# EAGLE schematic schematic (EAGLE 9.6.2)
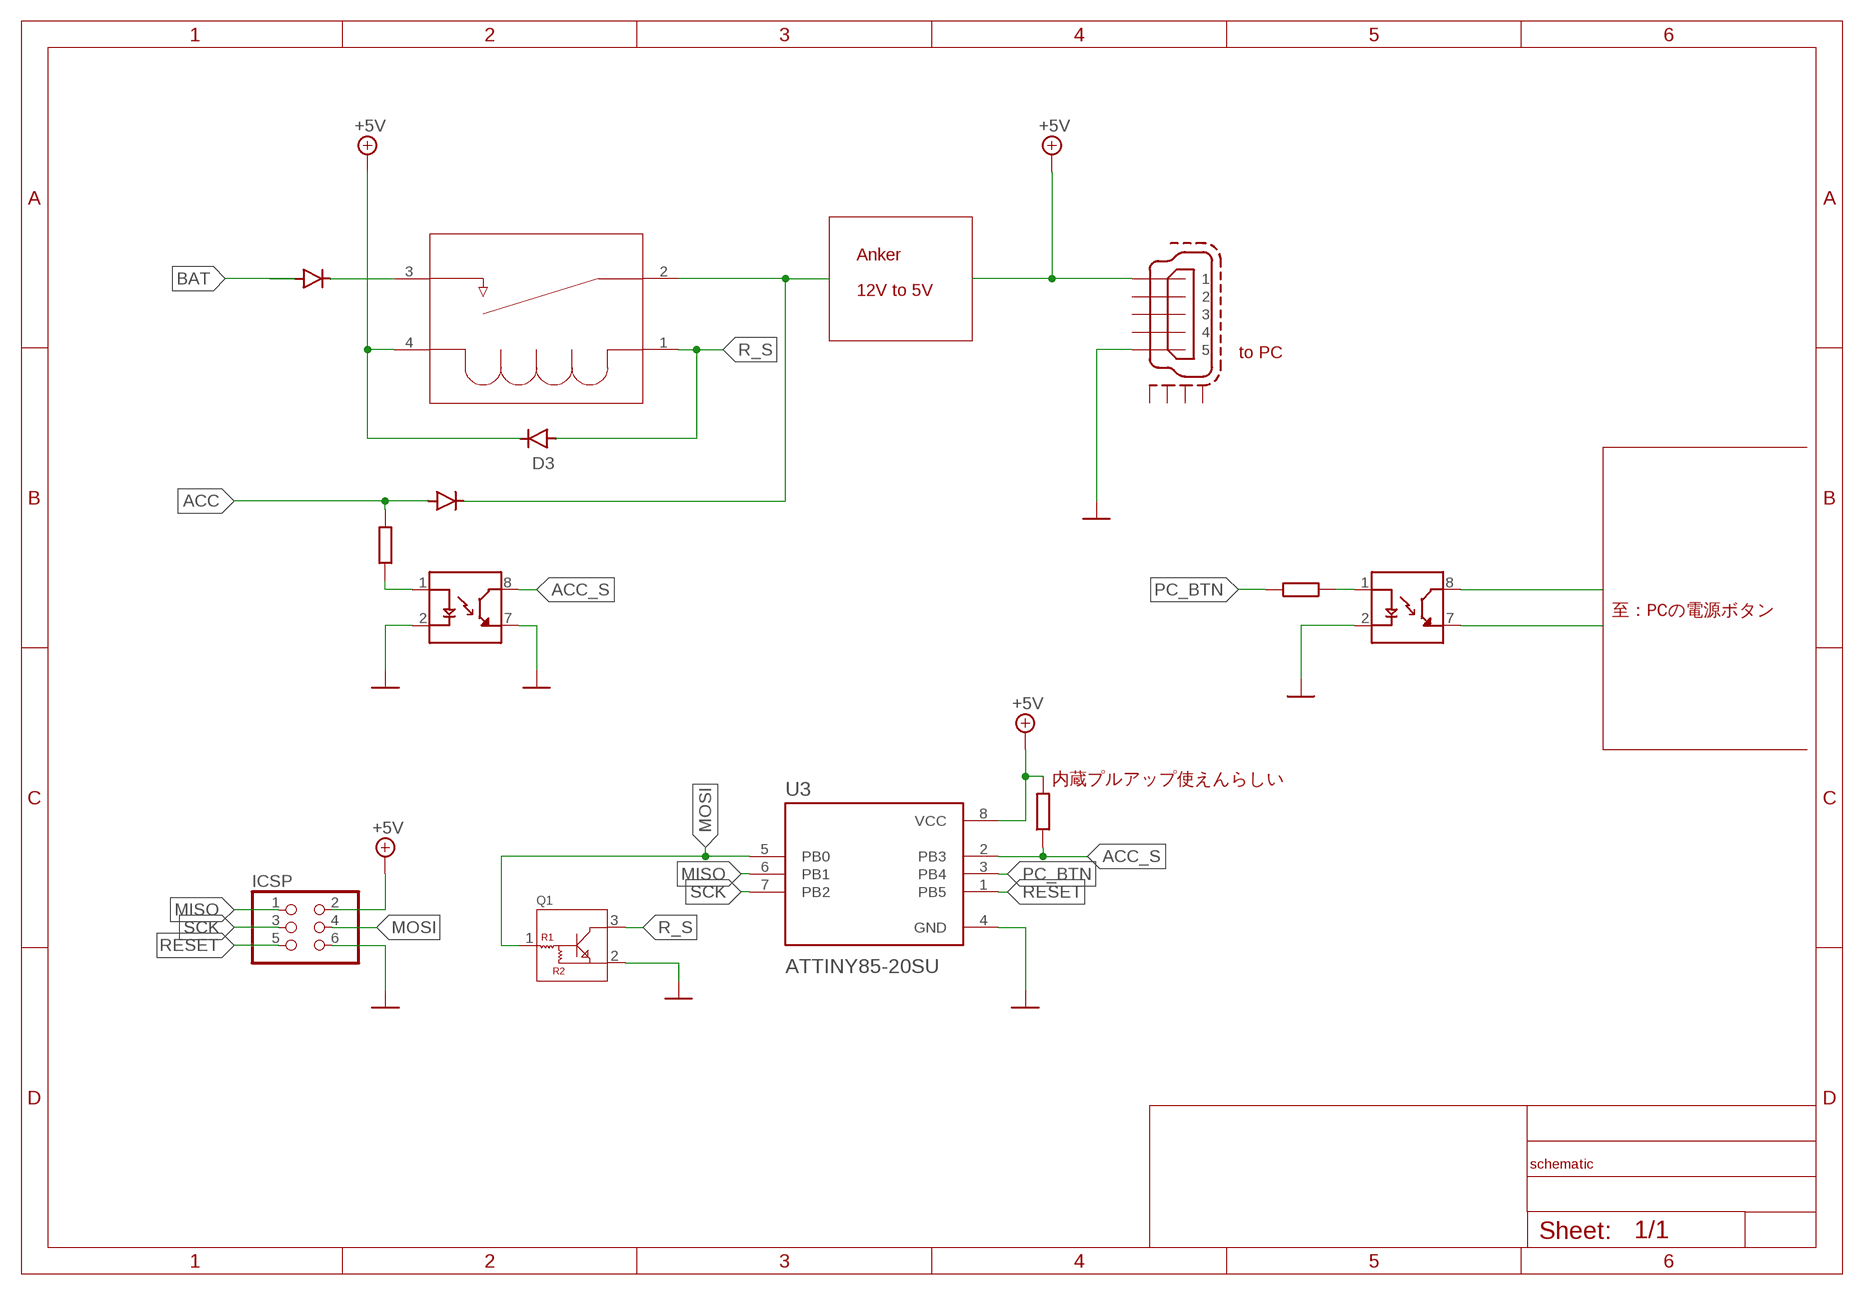
[diagram p0: schematic, sheet 1]

## Parts
D1  1N4004  [DO-41]
D3  1N4004  [DO-41]
D4  1N4004  [DO-41]
ICSP  PINHD-2X3  [2X03]
Q1  DTC114EM3T5G  [VMT3]
R1  R-EU_0204/5  [0204/5]
R2  R-EU_0204/5  [0204/5]
R3  R-EU_0204/5  [0204/5]
U1  2-1393222-0  [RELAY6-4-394X1126_591]
U2  TLP627-2  [DIP762W50P254L966H455Q8]
U3  ATTINY85-20SU  [SOIC127P798X216-8N]
U4  TLP627-2  [DIP762W50P254L966H455Q8]
X1  C-05843_USB-MINI-B32005-201  [32005-201]

## Nets
+5V: D3.C ICSP.2 R2.2 U1.4 U3.8(VCC) X1.1
ACC: D4.A D4.C R1.2 U1.2
ACC_S: R2.1 U2.8(CT1) U3.2(PB3)
BAT: D1.A
GND: ICSP.6 Q1.2 U2.2(C1) U2.7(ET1) U3.4(GND) U4.2(C1) X1.5
MISO: ICSP.1 U3.6(PB1)
MOSI: ICSP.4 Q1.1 U3.5(PB0)
N$1: D1.C U1.3
N$3: R1.1 U2.1(A1)
N$4: U4.8(CT1)
N$5: U4.7(ET1)
N$7: R3.1 U4.1(A1)
PC_BTN: R3.2 U3.3(PB4)
R_S: D3.A Q1.3 U1.1
RESET: ICSP.5 U3.1(PB5)
SCK: ICSP.3 U3.7(PB2)
Unconnected: U2.3(A2) U2.4(C2) U2.5(ET2) U2.6(CT2) U4.3(A2) U4.4(C2) U4.5(ET2) U4.6(CT2) X1.2 X1.3 X1.4 X1.M1(S:S1) X1.M2(S:S2) X1.M3(S:S3) X1.M4(S:S4)

## Notes on the sheet
- Anker
- 12V to 5V
- to PC
- 至：PCの電源ボタン
- 内蔵プルアップ使えんらしい

## Library data of the parts
D1 D3 D4 = Diodes:1N4004: DIODE GEN PURP 400V 1A DO41 Manufacturer's datasheet <https://www.mccsemi.com/pdf/Products/1N4001-1N4007(DO-41).pdf>; CREATED_BY: PCBLayout.com; DIGIKEY_PART_NUMBER: 1N4004MSCT-ND; MANUFACTURER: Micro Commercial Co; MPN: 1N4004; PACKAGE: DO-41
ICSP = pinhead:PINHD-2X3: PIN HEADER
Q1 = DTC114E:DTC114E: NPN Silicon Surface Mount Transistors with Monolithic Bias Resistor Network R1 = R2 = 10K Check availability <https://pricing.snapeda.com/parts/DTC114E/Nexperia%20USA/view-part?ref=eda>; AVAILABILITY: In Stock; DESCRIPTION: Pre-Biased Bipolar Transistor (BJT) NPN - Pre-Biased 50V 50mA 250MHz 200mW Surface Mount SMT3; MF: Nexperia USA; MP: DTC114E; PACKAGE: SC-59 Nexperia USA; PRICE: None; PURCHASE-URL: https://pricing.snapeda.com/search/part/DTC114E/?ref=eda
R1-R3 = rcl:R-EU_: RESISTOR, European symbol; SPICEPREFIX: R
U1 = Relays:2-1393222-0; BUILT_BY: EMA_UL_Team; CATEGORY: Power Relays; COPYRIGHT: Copyright (C) 2016 Accelerated Designs. All rights reserved; DESCRIPTION: V23061A1005A302=MINISTARKSTROM; MANUFACTURER_PART_NUMBER: 2-1393222-0; PART_STATUS: active; SERIES: SCHRACK Low Power PCB Relays; VENDOR: TE Connectivity
U2 U4 = TLP627-2:TLP627-2: Optoisolator Output Channel Check availability <https://pricing.snapeda.com/parts/TLP627-2/Toshiba/view-part?ref=eda>; AVAILABILITY: In Stock; DESCRIPTION: Optoisolator Output Channel; MF: Toshiba; MP: TLP627-2; PACKAGE: DIP-8 Toshiba; PRICE: None; PURCHASE-URL: https://pricing.snapeda.com/search/part/TLP627-2/?ref=eda
U3 = ATTINY85-20SU:ATTINY85-20SU: AVR AVR® ATtiny, Functional Safety (FuSa) Microcontroller IC 8-Bit 20MHz 8KB (4K x 16) FLASH 8-SOIC Check availability <https://pricing.snapeda.com/parts/ATTINY85-20SU/Microchip%20Technology%20/%20Atmel/view-part?ref=eda>; AVAILABILITY: In Stock; DESCRIPTION: AVR AVR® ATtiny, Functional Safety (FuSa) Microcontroller IC 8-Bit 20MHz 8KB (4K x 16) FLASH 8-SOIC; MF: Microchip Technology / Atmel; MP: ATTINY85-20SU; PACKAGE: SOIC-8 Microchip Technology; PRICE: None; PURCHASE-URL: https://pricing.snapeda.com/search/part/ATTINY85-20SU/?ref=eda
X1 = Akizuki:C-05843_USB-MINI-B: MINI USB-B Conector Source: www.cypressindustries.com; OC_FARNELL: unknown; OC_NEWARK: unknown